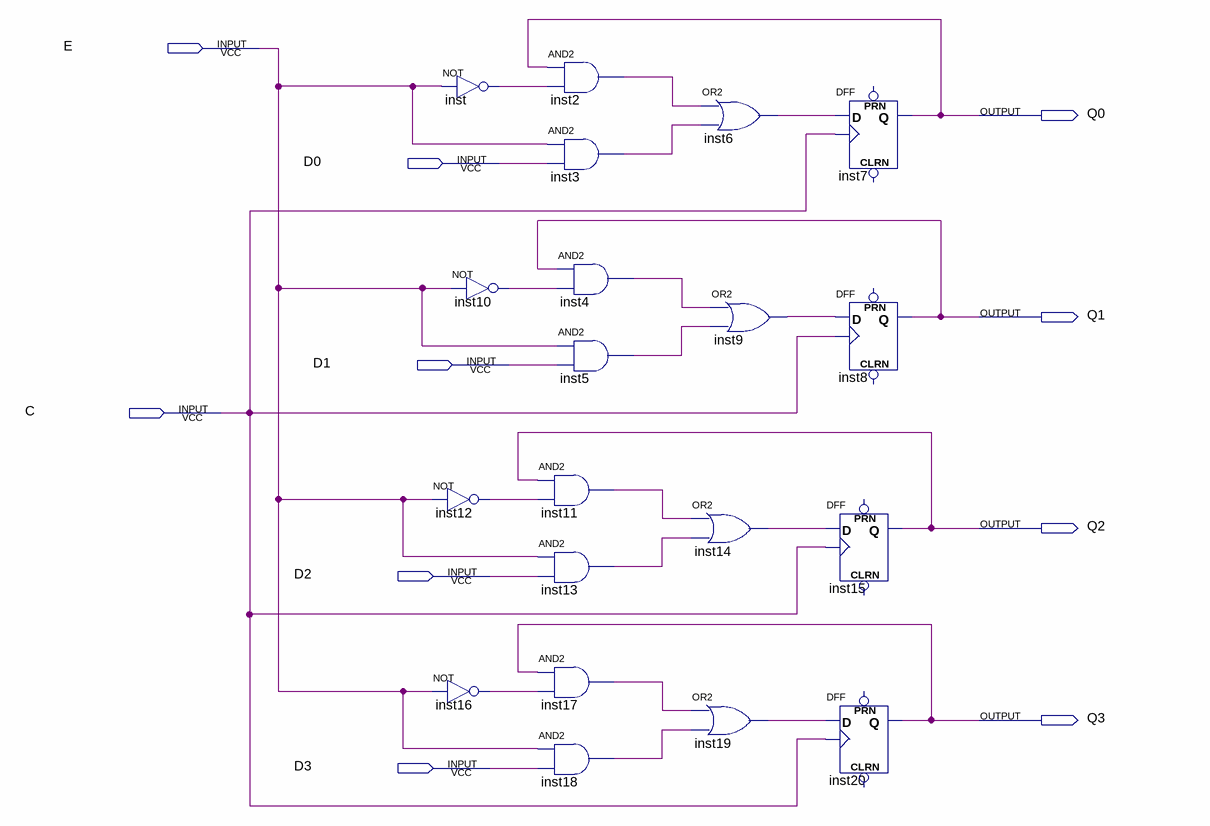
[diagram p0: schematic sheet]
// Quartus schematic Lab8.bdf as structural Verilog: 20 symbols, 10 pins
module Lab8 (
  input  E,
  input  D0,
  input  D1,
  input  C,
  input  D2,
  input  D3,
  output Q0,
  output Q1,
  output Q2,
  output Q3
);

  wire inst2_out, inst3_out, inst4_out, inst5_out, inst6_out, inst9_out, inst10_out, inst11_out, inst12_out,
       inst13_out, inst14_out, inst16_out, inst17_out, inst18_out, inst19_out, inst_out;

  not inst12 (inst12_out, E);
  not inst16 (inst16_out, E);
  not inst (inst_out, E);
  not inst10 (inst10_out, E);
  and inst2 (inst2_out, Q0, inst_out);
  and inst3 (inst3_out, E, D0);
  and inst4 (inst4_out, Q1, inst10_out);
  and inst5 (inst5_out, E, D1);
  and inst11 (inst11_out, Q2, inst12_out);
  and inst13 (inst13_out, E, D2);
  and inst17 (inst17_out, Q3, inst16_out);
  and inst18 (inst18_out, E, D3);
  or inst6 (inst6_out, inst2_out, inst3_out);
  or inst9 (inst9_out, inst4_out, inst5_out);
  or inst14 (inst14_out, inst11_out, inst13_out);
  or inst19 (inst19_out, inst17_out, inst18_out);
  DFF inst7 (.CLK(C), .D(inst6_out), .Q(Q0));  // open: CLRN, PRN
  DFF inst8 (.CLK(C), .D(inst9_out), .Q(Q1));  // open: CLRN, PRN
  DFF inst15 (.CLK(C), .D(inst14_out), .Q(Q2));  // open: CLRN, PRN
  DFF inst20 (.CLK(C), .D(inst19_out), .Q(Q3));  // open: CLRN, PRN
endmodule
